# Altium schematic sheet led.SchDoc
size A
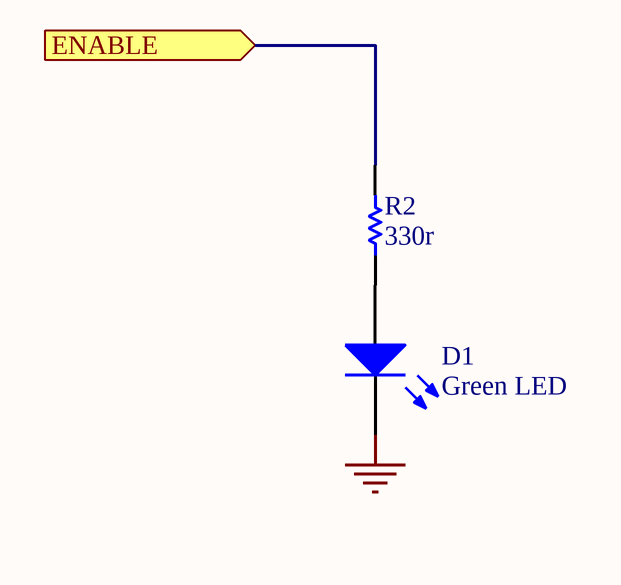
[diagram p0: led.SchDoc]

## Parts
D1  Green LED  [LED 0805]
R2  330r  [RESC1608N]

## Ports
ENABLE

## Nets
GND: D1.2(K)
ENABLE: R2.2 ; port ENABLE
NetD1_1: D1.1(A) R2.1

## Library data of the parts
D1 = LED0: Typical INFRARED GaAs LED; Fabricant: KINGBRIGHT; RefFabricant: KPT-2012SGC; Fournisseur: Farnell; RefFournisseur: 2099239; Published: 8-Jun-2000; LatestRevisionDate: 08-Jul-2005; LatestRevisionNote: Mech Layer 1 removed.; PackageReference: LED-0; Publisher: Altium Limited; PackageDescription: LED; 2 Leads
R2 = Res1: Resistor; Value: 1K; Precision: 1%; Published: 8-Jun-2000; LatestRevisionDate: 17-Jul-2002; LatestRevisionNote: Re-released for DXP Platform.; PackageReference: AXIAL-0.3; Publisher: Altium Limited; PackageDescription: Axial Device, Thru-Hole; 2 Leads; 0.3 in Pin Spacing